# Altium schematic sheet FPGA Bank 0.SchDoc
size A4
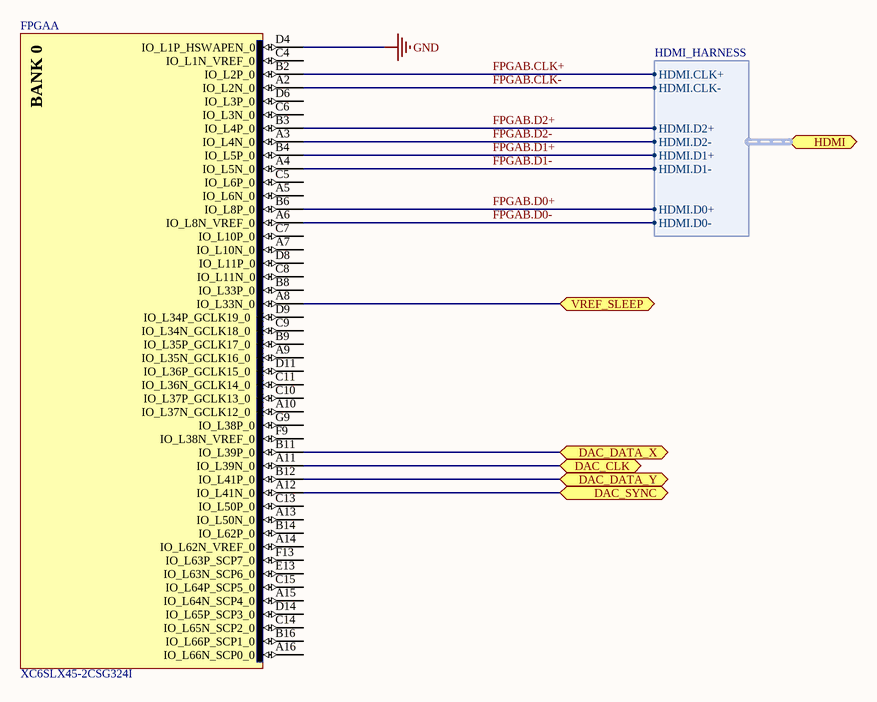
[diagram p0: FPGA Bank 0.SchDoc]

## Parts
FPGA  XC6SLX45-2CSG324I  [CSG324]  (part A of 8)

## Ports
DAC_CLK, DAC_DATA_X, DAC_DATA_Y, DAC_SYNC, HDMI (harness HDMI_HARNESS), VREF_SLEEP

## Harnesses
HDMI_HARNESS: HDMI.D2+, HDMI.D2-, HDMI.D1+, HDMI.D1-, HDMI.D0+, HDMI.D0-, HDMI.CLK+, HDMI.CLK-

## Nets
GND: FPGA.D4(IO_L1P_HSWAPEN_0)
DAC_CLK: FPGA.A11(IO_L39N_0) ; port DAC_CLK
DAC_DATA_X: FPGA.B11(IO_L39P_0) ; port DAC_DATA_X
DAC_DATA_Y: FPGA.B12(IO_L41P_0) ; port DAC_DATA_Y
DAC_SYNC: FPGA.A12(IO_L41N_0) ; port DAC_SYNC
FPGAB.CLK+: FPGA.B2(IO_L2P_0) ; port HDMI.HDMI.CLK+
FPGAB.CLK-: FPGA.A2(IO_L2N_0) ; port HDMI.HDMI.CLK-
FPGAB.D0+: FPGA.B6(IO_L8P_0) ; port HDMI.HDMI.D0+
FPGAB.D0-: FPGA.A6(IO_L8N_VREF_0) ; port HDMI.HDMI.D0-
FPGAB.D1+: FPGA.B4(IO_L5P_0) ; port HDMI.HDMI.D1+
FPGAB.D1-: FPGA.A4(IO_L5N_0) ; port HDMI.HDMI.D1-
FPGAB.D2+: FPGA.B3(IO_L4P_0) ; port HDMI.HDMI.D2+
FPGAB.D2-: FPGA.A3(IO_L4N_0) ; port HDMI.HDMI.D2-
VREF_SLEEP: FPGA.A8(IO_L33N_0) ; port VREF_SLEEP

Not connected (* = marked no-connect by the designer): FPGA A5(IO_L6N_0) A7(IO_L10N_0) A9(IO_L35N_GCLK16_0) A10(IO_L37N_GCLK12_0) A13(IO_L50N_0) A14(IO_L62N_VREF_0) A15(IO_L64N_SCP4_0) A16(IO_L66N_SCP0_0) B8(IO_L33P_0) B9(IO_L35P_GCLK17_0) B14(IO_L62P_0) B16(IO_L66P_SCP1_0) C4(IO_L1N_VREF_0) C5(IO_L6P_0) C6(IO_L3N_0) C7(IO_L10P_0) C8(IO_L11N_0) C9(IO_L34N_GCLK18_0) C10(IO_L37P_GCLK13_0) C11(IO_L36N_GCLK14_0) C13(IO_L50P_0) C14(IO_L65N_SCP2_0) C15(IO_L64P_SCP5_0) D6(IO_L3P_0) D8(IO_L11P_0) D9(IO_L34P_GCLK19_0) D11(IO_L36P_GCLK15_0) D14(IO_L65P_SCP3_0) E13(IO_L63N_SCP6_0) F9(IO_L38N_VREF_0) F13(IO_L63P_SCP7_0) G9(IO_L38P_0)

## Notes on the sheet
- (in symbol XC6SLX45-2CSG324I, part A) BANK 0

## Library data of the parts
FPGA = XC6SLX45-2CSG324I: Spartan-6 LX 1.2V FPGA, 218 User I/Os, 324-Ball Chip-Scale BGA (0.8mm Pitch), Speed Grade 2, Industrial Grade, Pb-Free; Published: 17-Nov-2009; DatasheetVersion: ver1.6, Nov-2010; PackageVersion: ver1.1, Nov-2009; PackageReference: CSG324; Publisher: Altium Limited; PackageDescription: 324-Ball Chip-Scale BGA (CSG324) Package, 0.8 mm Pitch; Supplier 1: Digi-Key; Supplier Part Number 1: XC6SLX45-2CSG324I-ND; Code_JEDEC: MO-275-KKAC-1; ComponentLink1Description: Manufacturer Link; ComponentLink1URL: http://www.xilinx.com; ComponentLink2Description: Spartan-6 Datasheet; ComponentLink2URL: http://www.xilinx.com/support/documentation/data_sheets/ds160.pdf; ComponentLink3Description: Spartan-6 Documents; ComponentLink3URL: http://www.xilinx.com/support/documentation/spartan-6.htm; ComponentLink4Description: Xilinx.com Home; ComponentLink4URL: http://www.xilinx.com